# EAGLE design ESP_Robo_Board (EAGLE 9.6.2)
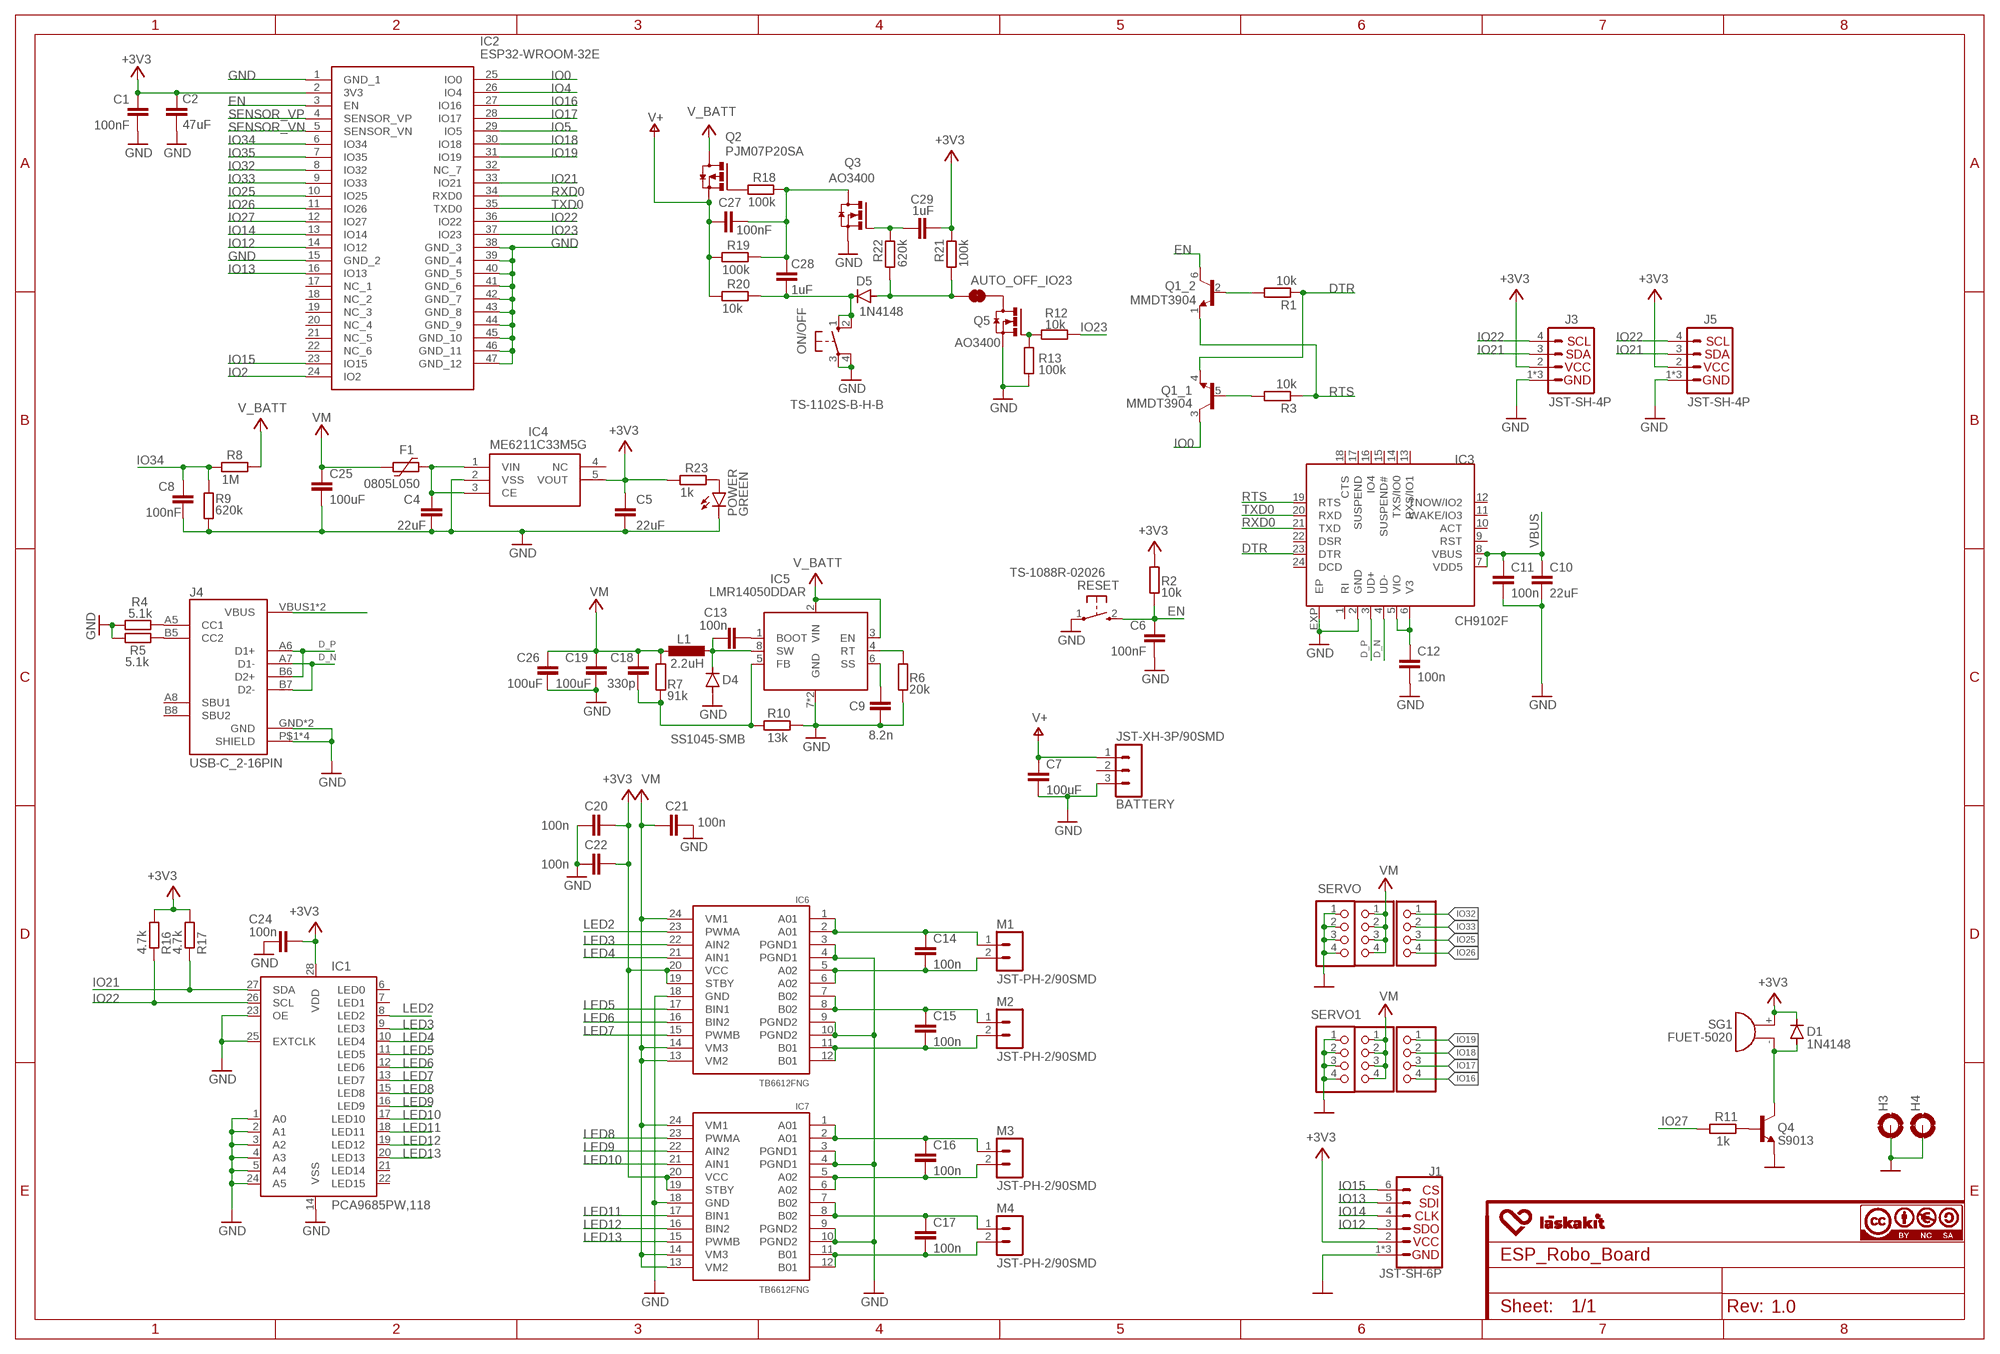
[diagram p0: schematic, sheet 1]
FRAME1 (FRAME-A3L): CREVISION: 1.0

## Parts
1  PINHD_1X4_RED  PINHD-1X4  [1X04]
2  PINHD_1X4_BLACK  PINHD-1X4  [1X04]
5  PINHD_1X4_RED  PINHD-1X4  [1X04]
6  PINHD_1X4_BLACK  PINHD-1X4  [1X04]
AUTO_OFF_IO23  nv  JUMPER-SMT_2_NC_TRACE_SILK  [SMT-JUMPER_2_NC_TRACE_SILK]
BATTERY  JST-XH-3P/90SMD  JST-XH-3/90SMD  [S3B-XH-SM4]
C1  100nF  C-EUC0603  [C0603]
C2  47uF  C-EUC0805  [C0805]
C4  22uF  C-EUC0603  [C0603]
C5  22uF  C-EUC0603  [C0603]
C6  100nF  CAPACITOR_0402  [C0402]
C7  100uF  C-EUC1206  [C1206]
C8  100nF  CAPACITOR_0402  [C0402]
C9  8.2n  C-EUC0603  [C0603]
C10  22uF  C-EUC0603  [C0603]
C11  100n  CAPACITOR_0402  [C0402]
C12  100n  CAPACITOR_0402  [C0402]
C13  100n  C-EUC0603  [C0603]
C14  100n  C-EUC0603  [C0603]
C15  100n  C-EUC0603  [C0603]
C16  100n  C-EUC0603  [C0603]
C17  100n  C-EUC0603  [C0603]
C18  330p  CAPACITOR_0402  [C0402]
C19  100uF  C-EUC1206  [C1206]
C20  100n  C-EUC0603  [C0603]
C21  100n  C-EUC0603  [C0603]
C22  100n  C-EUC0603  [C0603]
C24  100n  C-EUC0603  [C0603]
C25  100uF  C-EUC1206  [C1206]
C26  100uF  C-EUC1206  [C1206]
C27  100nF  CAPACITOR_0402  [C0402]
C28  1uF  C-EUC0603  [C0603]
C29  1uF  C-EUC0603  [C0603]
D1  1N4148  DIODE-SOD323-R  [SOD323-R]
D4  SS1045-SMB  DIODE-SMB  [SMB]
D5  1N4148  DIODE-SOD323-R  [SOD323-R]
F1  0805L050  [0805L]
H3  MOUNT-PAD-ROUND2.5  [2,5-PAD]
H4  MOUNT-PAD-ROUND2.5  [2,5-PAD]
IC1  PCA9685PW,118  [TSSOP28]
IC2  ESP32-WROOM-32E  [ESP32WROOM32E]
IC3  CH9102F  USB_UART_CONVERTOR_CH9102  [QFN24-4X4]
IC4  ME6211C33M5G  LDO_ME6211C33M5G  [SOT23-5]
IC5  LMR14050DDAR  [SO08-EPAD]
IC6  TB6612FNG  MOTOR_DRIVER_TB6612FNG  [SSOP24]
IC7  TB6612FNG  MOTOR_DRIVER_TB6612FNG  [SSOP24]
J1  JST-SH-6P  USUP_SPI_CONNECTOR_VERT  [1X06_1MM_RA_VERT]
J3  JST-SH-4P  USUP_I2C_CONNECTOR_VERT  [1X04_1MM_RA_VERT]
J4  USB-C_2-16PIN  [USBC_USB-C-16P-5]
J5  JST-SH-4P  USUP_I2C_CONNECTOR_VERT  [1X04_1MM_RA_VERT]
L1  2.2uH  INDUCTOR_5.4X5.2  [L5.4X5.2]
M1  JST-PH-2/90SMD  [S2B-PH-SM4]
M2  JST-PH-2/90SMD  [S2B-PH-SM4]
M3  JST-PH-2/90SMD  [S2B-PH-SM4]
M4  JST-PH-2/90SMD  [S2B-PH-SM4]
ON/OFF  TS-1102S-B-H-B  10-XX-SMD  [B3F-SMD]
POWER  GREEN  LEDCHIPLED_0402  [CHIPLED_0402]
Q1  MMDT3904  TRANS_NPN_DUAL-MBT3904DW1T1  [SC70-6]
Q2  PJM07P20SA  MOSFET_P-SOT-23  [SOT23]
Q3  AO3400  MOSFET_N-SOT-23  [SOT23]
Q4  S9013  BC817-16-NPN-SOT23-BEC  [SOT23-BEC]
Q5  AO3400  MOSFET_N-SOT-23  [SOT23]
R1  10k  R-EU_R0402  [R0402]
R2  10k  R-EU_R0402  [R0402]
R3  10k  R-EU_R0402  [R0402]
R4  5.1k  R-EU_R0402  [R0402]
R5  5.1k  R-EU_R0402  [R0402]
R6  20k  R-EU_R0402  [R0402]
R7  91k  R-EU_R0402  [R0402]
R8  1M  R-EU_R0402  [R0402]
R9  620k  R-EU_R0402  [R0402]
R10  13k  R-EU_R0402  [R0402]
R11  1k  R-EU_R0402  [R0402]
R12  10k  R-EU_R0402  [R0402]
R13  100k  R-EU_R0402  [R0402]
R16  4.7k  R-EU_R0402  [R0402]
R17  4.7k  R-EU_R0402  [R0402]
R18  100k  R-EU_R0402  [R0402]
R19  100k  R-EU_R0402  [R0402]
R20  10k  R-EU_R0402  [R0402]
R21  100k  R-EU_R0402  [R0402]
R22  620k  R-EU_R0402  [R0402]
R23  1k  R-EU_R0402  [R0402]
RESET  TS-1088R-02026  MOMENTARY_SWITCH_TS-1088R-02026  [TS1088R02026]
SERVO  PINHD_1X4_YELLOW  PINHD-1X4  [1X04]
SERVO1  PINHD_1X4_YELLOW  PINHD-1X4  [1X04]
SG1  FUET-5020  PASSIVE_BUZZER_3V_FUET-5020  [FUET-5020]

## Nets
+3V3: C1.1 C2.1 C5.1 C20.2 C22.2 C24.2 C29.1 D1.C IC1.28(VDD) IC2.2(3V3) IC4.5(VOUT) IC6.19(STBY) IC6.20(VCC) IC7.19(STBY) IC7.20(VCC) J1.2(VCC) J3.2(VCC) J5.2(VCC) R2.1 R16.2 R17.2 R21.2 R23.1 SG1.+
+6V: 1.1 1.2 1.3 1.4 5.1 5.2 5.3 5.4 C18.1 C19.1 C21.1 C25.1 C26.1 F1.2 IC6.13(VM2) IC6.14(VM3) IC6.24(VM1) IC7.13(VM2) IC7.14(VM3) IC7.24(VM1) L1.2 R7.1 ; supply symbol labelled VM
D_N: IC3.4(UD-) J4.A7(D1-) J4.B7(D2-)
D_P: IC3.3(UD+) J4.A6(D1+) J4.B6(D2+)
DTR: IC3.23(DTR) Q1.4(_1:E) R1.1
EN: C6.1 IC2.3(EN) Q1.6(_2:C) R2.2 RESET.2
GND: 2.1 2.2 2.3 2.4 6.1 6.2 6.3 6.4 BATTERY.3 C1.2 C2.2 C4.2 C5.2 C6.2 C7.2 C8.2 C9.2 C10.2 C11.2 C12.2 C19.2 C20.1 C21.2 C22.1 C24.1 C25.2 C26.2 D4.A H3.1(MOUNT) H4.1(MOUNT) IC1.1(A0) IC1.2(A1) IC1.3(A2) IC1.4(A3) IC1.5(A4) IC1.14(VSS) IC1.23(OE) IC1.24(A5) IC1.25(EXTCLK) IC2.1(GND_1) IC2.15(GND_2) IC2.38(GND_3) IC2.39(GND_4) IC2.40(GND_5) IC2.41(GND_6) IC2.42(GND_7) IC2.43(GND_8) IC2.44(GND_9) IC2.45(GND_10) IC2.46(GND_11) IC2.47(GND_12) IC3.2(GND) IC3.EXP(EP) IC4.2(VSS) IC5.7(GND) IC5.EPAD(GND) IC6.3(PGND1) IC6.4(PGND1) IC6.9(PGND2) IC6.10(PGND2) IC6.18(GND) IC7.3(PGND1) IC7.4(PGND1) IC7.9(PGND2) IC7.10(PGND2) IC7.18(GND) J1.1(GND) J1.NC1(GND) J1.NC2(GND) J3.1(GND) J3.NC1(GND) J3.NC2(GND) J4.GND J4.GND2(GND) J4.P$1(SHIELD) J4.P$2(SHIELD) J4.P$3(SHIELD) J4.P$4(SHIELD) J5.1(GND) J5.NC1(GND) J5.NC2(GND) ON/OFF.3(P) ON/OFF.4(P1) POWER.C Q3.2(S) Q4.E Q5.2(S) R4.1 R5.1 R6.2 R9.1 R10.2 R13.1 RESET.1
IO0: IC2.25(IO0) Q1.3(_1:C)
IO2: IC2.24(IO2)
IO4: IC2.26(IO4)
IO5: IC2.29(IO5)
IO12: IC2.14(IO12) J1.3(SDO)
IO13: IC2.16(IO13) J1.5(SDI)
IO14: IC2.13(IO14) J1.4(CLK)
IO15: IC2.23(IO15) J1.6(CS)
IO16: IC2.27(IO16) SERVO1.4
IO17: IC2.28(IO17) SERVO1.3
IO18: IC2.30(IO18) SERVO1.2
IO19: IC2.31(IO19) SERVO1.1
IO21: IC1.27(SDA) IC2.33(IO21) J3.3(SDA) J5.3(SDA) R17.1
IO22: IC1.26(SCL) IC2.36(IO22) J3.4(SCL) J5.4(SCL) R16.1
IO23: IC2.37(IO23) R12.2
IO25: IC2.10(IO25) SERVO.3
IO26: IC2.11(IO26) SERVO.4
IO27: IC2.12(IO27) R11.1
IO32: IC2.8(IO32) SERVO.1
IO33: IC2.9(IO33) SERVO.2
IO34: C8.1 IC2.6(IO34) R8.1 R9.2
IO35: IC2.7(IO35)
LED2: IC1.8(LED2) IC6.23(PWMA)
LED3: IC1.9(LED3) IC6.22(AIN2)
LED4: IC1.10(LED4) IC6.21(AIN1)
LED5: IC1.11(LED5) IC6.17(BIN1)
LED6: IC1.12(LED6) IC6.16(BIN2)
LED7: IC1.13(LED7) IC6.15(PWMB)
LED8: IC1.15(LED8) IC7.23(PWMA)
LED9: IC1.16(LED9) IC7.22(AIN2)
LED10: IC1.17(LED10) IC7.21(AIN1)
LED11: IC1.18(LED11) IC7.17(BIN1)
LED12: IC1.19(LED12) IC7.16(BIN2)
LED13: IC1.20(LED13) IC7.15(PWMB)
N$1: C4.1 F1.1 IC4.1(VIN) IC4.3(CE)
N$2: J4.A5(CC1) R4.2
N$3: C13.1 D4.C IC5.8(SW) L1.1
N$4: Q1.5(_1:B) R3.2
N$5: C9.1 IC5.6(SS)
N$6: IC5.4(RT) R6.1
N$7: J4.B5(CC2) R5.2
N$8: Q4.B R11.2
N$9: POWER.A R23.2
N$10: C13.2 IC5.1(BOOT)
N$12: Q1.2(_2:B) R1.2
N$13: Q5.1(G) R12.1 R13.2
N$14: D1.A Q4.C SG1.-
N$15: C12.1 IC3.5(VIO) IC3.6(V3)
N$16: AUTO_OFF_IO23.2 Q5.3(D)
N$17: C18.2 IC5.5(FB) R7.2 R10.1
N$18: C14.1 IC6.1(A01) IC6.2(A01) M1.1
N$19: C14.2 IC6.5(A02) IC6.6(A02) M1.2
N$20: C15.1 IC6.7(B02) IC6.8(B02) M2.1
N$22: Q2.1(G) R18.1
N$23: C15.2 IC6.11(B01) IC6.12(B01) M2.2
N$24: C16.1 IC7.1(A01) IC7.2(A01) M3.1
N$25: C28.2 D5.C ON/OFF.1(S) ON/OFF.2(S1) R20.2
N$26: C16.2 IC7.5(A02) IC7.6(A02) M3.2
N$27: C17.1 IC7.7(B02) IC7.8(B02) M4.1
N$28: C27.2 C28.1 Q3.3(D) R18.2 R19.2
N$29: C17.2 IC7.11(B01) IC7.12(B01) M4.2
N$30: C29.2 Q3.1(G) R22.2
N$31: AUTO_OFF_IO23.1 D5.A R21.1 R22.1
RTS: IC3.19(RTS) Q1.1(_2:E) R3.1
RXD0: IC2.34(RXD0) IC3.21(TXD)
SENSOR_VN: IC2.5(SENSOR_VN)
SENSOR_VP: IC2.4(SENSOR_VP)
TXD0: IC2.35(TXD0) IC3.20(RXD)
V+: BATTERY.1 C7.1 C27.1 Q2.2(S) R19.1 R20.1
V_BATT: IC5.2(VIN) IC5.3(EN) Q2.3(D) R8.2
VBUS: C10.1 C11.1 IC3.7(VDD5) IC3.8(VBUS) J4.VBUS1(VBUS) J4.VBUS2(VBUS)
Unconnected: BATTERY.2 IC1.6(LED0) IC1.7(LED1) IC1.21(LED14) IC1.22(LED15) IC2.17(NC_1) IC2.18(NC_2) IC2.19(NC_3) IC2.20(NC_4) IC2.21(NC_5) IC2.22(NC_6) IC2.32(NC_7) IC3.1(RI) IC3.9(RST) IC3.10(ACT) IC3.11(WAKE/IO3) IC3.12(TNOW/IO2) IC3.13(RXS/IO1) IC3.14(TXS/IO0) IC3.15(SUSPEND#) IC3.16(IO4) IC3.17(SUSPEND) IC3.18(CTS) IC3.22(DSR) IC3.24(DCD) IC4.4(NC) J4.A8(SBU1) J4.B8(SBU2)

## Library data of the parts
1 2 5 6 SERVO SERVO1 = LasKKit-Connectors:PINHD-1X4: PIN HEADER
AUTO_OFF_IO23 = LaskaKit-Jumpers:JUMPER-SMT_2_NC_TRACE: Normally closed trace jumper This jumper has a trace between two pads so it's normally closed (NC). Use a razor knife to open the connection. For best results follow the IPC guidelines for cutting traces: Cutout at least 0.063 mm (0.005 in). Remove all loose material to clean up the cut area. Seal the cut with an approved epoxy. Reapply solder to reclose the connection.
BATTERY = LasKKit-Connectors:JST-XH-3
C1 C2 C4 C7 C9 C10 C13-C17 C19-C22 C24-C26 C28 C29 = rcl:C-EU: CAPACITOR, European symbol; SPICEPREFIX: C
C5 = rcl:C-EU: CAPACITOR, European symbol; LCSC_PART: C19666; SPICEPREFIX: C
C6 C8 C11 C12 C18 C27 = LasKKIT-Passive:CAPACITOR
D1 = LasKKit-Discrete:DIODE-: DIODE; LCSC_PART: C94001
D4 = diode:DIODE-: DIODE; LCSC_PART: C2903947
D5 = LasKKit-Discrete:DIODE-: DIODE
F1 = polyfuse-smd_10:?: Polyfuse Resettable PTC Source: http://www.littelfuse.com/products/resettable-ptcs.aspx; LCSC_PART: C66452; MF: Littelfuse; MPN: 0805L050; OC_FARNELL: 1832103; OC_NEWARK: 18M4776
H3 H4 = LasKKit-Holes:MOUNT-PAD-ROUND: MOUNTING PAD, round
IC1 = LasKKit-IC:PCA9685: 16-channel, 12-bit PWM Fm+ I2C-bus LED controller; LCSC_PART: C2678753
IC2 = LasKKit-Modules:ESP32-WROOM-32E: ESP32-D0WD-V3 embedded, Xtensa dual-core 32-bit LX6 microprocessor, up to 240 MHz Source: Datasheet <https://www.espressif.com/sites/default/files/documentation/esp32-wroom-32e_esp32-wroom-32ue_datasheet_en.pdf>; DESCRIPTION: ESP32-D0WD-V3 embedded, Xtensa dual-core 32-bit LX6 microprocessor, up to 240 MHz; HEIGHT: 3.25mm; MANUFACTURER_NAME: Espressif Systems; MANUFACTURER_PART_NUMBER: ESP32-WROOM-32E
IC3 = LasKKit-IC:USB_UART_CONVERTOR_CH9102: Single-Chip USB to UART Bridge
IC4 = LasKKit-Power:LDO_ME6211C33M5G: High Speed LDO Regulators, High PSRR, Low noise, ME6211 Series Source: Datasheet <http://xinhuidianzi.com.cn/UploadSysFiles/files/LDO-series/ME6211-Series_E15.0.pdf>; DESCRIPTION: High Speed LDO Regulators, High PSRR, Low noise, ME6211 Series; HEIGHT: 1.45mm; MANUFACTURER_NAME: Microne; MANUFACTURER_PART_NUMBER: ME6211C33M5G
IC5 = LasKKit-Power:LMR14050; LCSC_PART: C155484
IC6 IC7 = LasKKit-IC:MOTOR_DRIVER_TB6612FNG: Toshiba 1A dual motor driver IC-09363; PROD_ID: IC-09363
J1 = LasKKit-Connectors:USUP_SPI_CONNECTOR: LaskaKit SPI Standard μŠup Connector An SMD 1mm pitch JST connector makes it easy and quick (Šup) to connect SPI devices to each other. The μŠup system enables fast and solderless connection between popular platforms and various sensors and actuators.; LCSC_PART: C145963
J3 J5 = LasKKit-Connectors:USUP_I2C_CONNECTOR: LaskaKit I2C Standard μŠup Connector An SMD 1mm pitch JST connector makes it easy and quick (Šup) to connect I2C devices to each other. The μŠup system enables fast and solderless connection between popular platforms and various sensors and actuators.; LCSC_PART: C371588
J4 = LasKKit-Connectors:USB-C_2: https://lcsc.com/product-detail/USB-Connectors_G-Switch-GT-USB-7010B_C2837092.html; LCSC_PART: C2837092
L1 = LasKKIT-Passive:INDUCTOR; LCSC_PART: C351096
M1-M4 = LasKKit-Connectors:JST-PH-2: HEADER; LCSC_PART: C47647
ON/OFF = LasKKit-Switch:10-XX: OMRON SWITCH
POWER = LasKKit-Discrete:LED: LED OSRAM: - CHIPLED LG R971, LG N971, LY N971, LG Q971, LY Q971, LO R971, LY R971 LH N974, LH R974 LS Q976, LO Q976, LY Q976 LO Q996 - Hyper CHIPLED LW Q18S LB Q993, LB Q99A, LB R99A - SideLED LS A670, LO A670, LY A670, LG A670, LP A670 LB A673, LV A673, LT A673, LW A673 LH A674 LY A675 LS A676, LA A676, LO A676, LY A676, LW A676 LS A679, LY A679, LG A679 - Hyper Micro SIDELED® LS Y876, LA Y876, LO Y876, LY Y876 LT Y87S - SmartLED LW L88C, LW L88S LB L89C, LB L89S, LG L890 LS L89K, LO L89K, LY L89K LS L896, LA L896, LO L896, LY L896 - TOPLED LS T670, LO T670, LY T670, LG T670, LP T670 LSG T670, LSP T670, LSY T670, LOP T670, LYG T670 LG T671, LOG T671, LSG T671 LB T673, LV T673, LT T673, LW T673 LH T674 LS T676, LA T676, LO T676, LY T676, LB T676, LH T676, LSB T676, LW T676 LB T67C, LV T67C, LT T67C, LS T67K, LO T67K, LY T67K, LW E67C LS E67B, LA E67B, LO E67B, LY E67B, LB E67C, LV E67C, LT E67C LW T67C LS T679, LY T679, LG T679 LS T770, LO T770, LY T770, LG T770, LP T770 LB T773, LV T773, LT T773, LW T773 LH T774 LS E675, LA E675, LY E675, LS T675 LS T776, LA T776, LO T776, LY T776, LB T776 LHGB T686 LT T68C, LB T68C - Hyper Mini TOPLED® LB M676 - Mini TOPLED Santana® LG M470 LS M47K, LO M47K, LY M47K Source: http://www.osram.convergy.de LUXEON: - LUMILED® LXK2-PW12-R00, LXK2-PW12-S00, LXK2-PW14-U00, LXK2-PW14-V00 LXK2-PM12-R00, LXK2-PM12-S00, LXK2-PM14-U00 LXK2-PE12-Q00, LXK2-PE12-R00, LXK2-PE12-S00, LXK2-PE14-T00, LXK2-PE14-U00 LXK2-PB12-K00, LXK2-PB12-L00, LXK2-PB12-M00, LXK2-PB14-N00, LXK2-PB14-P00, LXK2-PB14-Q00 LXK2-PR12-L00, LXK2-PR12-M00, LXK2-PR14-Q00, LXK2-PR14-R00 LXK2-PD12-Q00, LXK2-PD12-R00, LXK2-PD12-S00 LXK2-PH12-R00, LXK2-PH12-S00 LXK2-PL12-P00, LXK2-PL12-Q00, LXK2-PL12-R00 Source: www.luxeon.com KINGBRIGHT: KA-3528ASYC Source: www.kingbright.com
Q1 = LasKKit-Discrete:TRANS_NPN_DUAL: Dual NPN Transistors in Single Package The MBT3904W1 puts two general purpose 3904 NPN transistors in a single package. Datasheet <http://www.onsemi.com/pub_link/Collateral/MBT3904DW1T1-D.PDF> SparkFun Products: SparkFun ESP32 Thing <https://www.sparkfun.com/products/13907>; LCSC_PART: C268586; PROD_ID: TRANS-13337
Q2 = LasKKit-Discrete:MOSFET_P; LCSC_PART: C2856842
Q3 Q5 = LasKKit-Discrete:MOSFET_N; LCSC_PART: C693097
Q4 = transistor:*-NPN-: NPN Transistror BF959 corrected 2008.03.06; LCSC_PART: C52801
R1-R10 R12 R13 R16-R23 = rcl:R-EU_: RESISTOR, European symbol; SPICEPREFIX: R
R11 = rcl:R-EU_: RESISTOR, European symbol; LCSC_PART: C22548; SPICEPREFIX: R
RESET = LasKKit-Switch:MOMENTARY_SWITCH_TS-1088R-02026: SMD,3x4x2.0mm Tactile Switches Source: Datasheet <https://datasheet.lcsc.com/szlcsc/1912111437_XUNPU-TS-1088R-02026_C455280.pdf>; DESCRIPTION: SMD,3x4x2.0mm Tactile Switches; HEIGHT: 2.2mm; LCSC_PART: C455280; MANUFACTURER_NAME: XUNPU; MANUFACTURER_PART_NUMBER: TS-1088R-02026
SG1 = LasKKit-Electromechanical:PASSIVE_BUZZER_3V; LCSC_PART: C391029

## Net classes
1 power: width 0.152 mm, drill 0.33 mm, clearance 0.152 mm

## Board
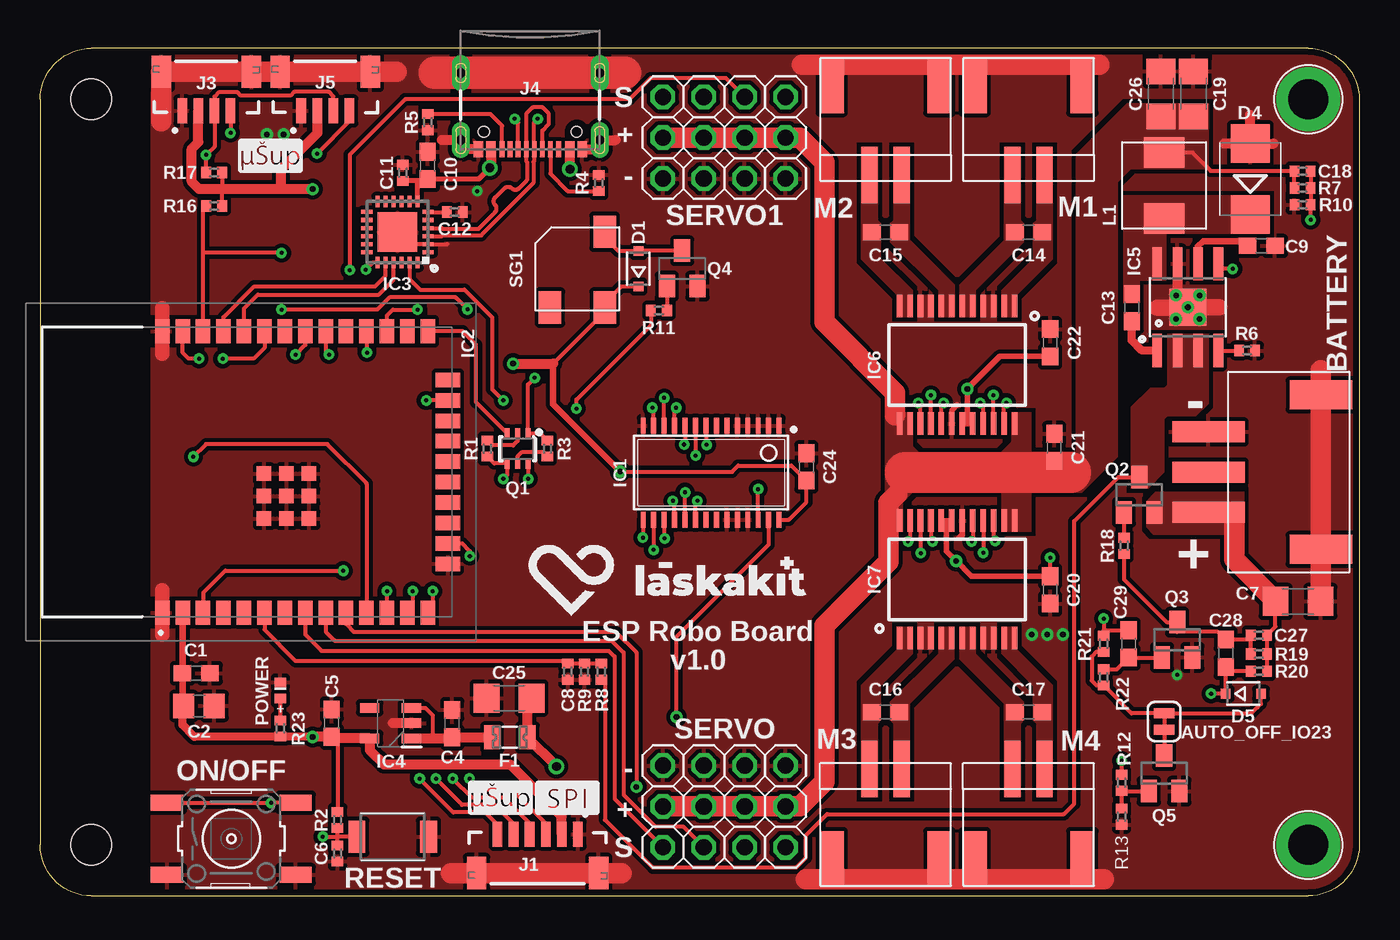
[diagram p1: board, top side]
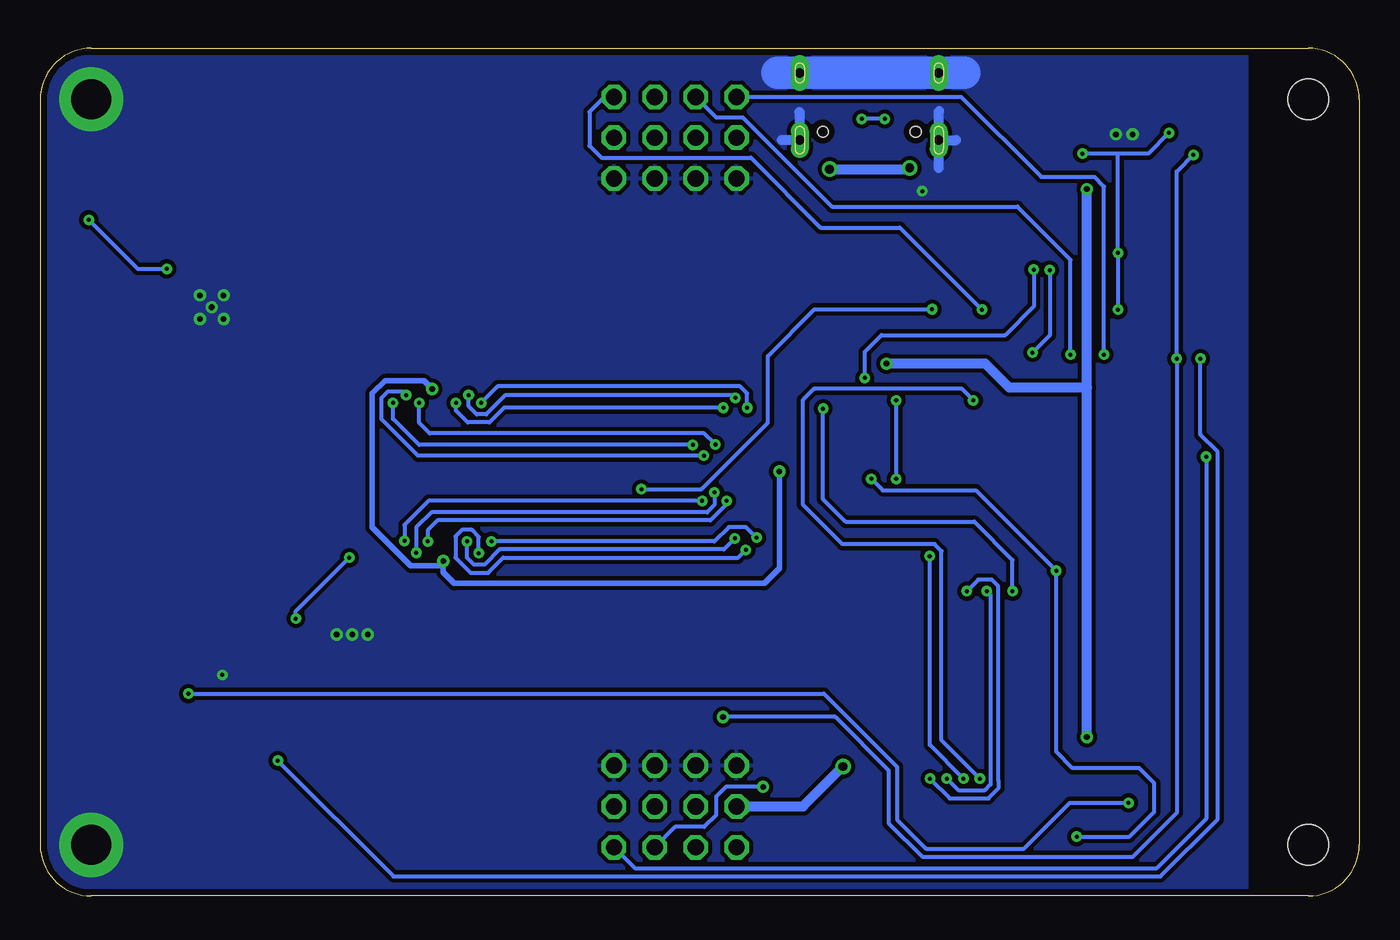
[diagram p2: board, bottom side, seen from below]

Size 82.04 x 52.7 mm. Coordinates in mm from the lower left corner, seen from the top.
Outline: 3.17,0 78.87,0 arc90 82.04,3.17 82.04,49.53 arc90 78.87,52.7 3.17,52.7 arc90 0,49.53 0,3.17 arc90 3.17,0
Copper layers (1*16): Top 0.035mm / dielectric 1.5mm / Bottom 0.035mm
Design rules "default *": minimum track width 10mil, minimum drill 0.25mm, track to track 6mil, track to pad 6mil, pad to pad 6mil, via to via 6mil, smd to smd 6mil, copper to edge 16mil, drill to drill 6mil, minimum pad ring 10mil, minimum via ring 8mil, stop-mask expansion 4mil, vias tented up to drill 25mil, thermal gap 10mil
Holes 2.5 mm at 3.17,3.17 3.17,49.53

### Footprints (pad centres in the part's own frame; a part is rotated, then mirrored left to right if it is on the bottom)
1X04 = drill 1.016 octagon: 1 -3.81,0; 2 -1.27,0; 3 1.27,0; 4 3.81,0
SMT-JUMPER_2_NC_TRACE_SILK = smd 0.635 x 1.27: 1 -0.508,0; 2 0.508,0
S3B-XH-SM4 = smd 1.3 x 4.5: 1 2.5,-8.75; 2 0,-8.75; 3 -2.5,-8.75 | smd 1.8 x 3.9: P$1 -4.8,-1.75; P$2 4.8,-1.75
C0603 = smd 1.1 x 1: 1 -0.85,0; 2 0.85,0
C0805 = smd 1.3 x 1.5: 1 -0.95,0; 2 0.95,0
C0402 = smd 0.6 x 0.7: 1 -0.5,0; 2 0.5,0
C1206 = smd 1.6 x 1.8: 1 -1.4,0; 2 1.4,0
SOD323-R = smd 0.6 x 0.6: A 1.1,0; C -1.1,0
SMB = smd 2.4 x 2.4: A 2.2,0; C -2.2,0
0805L = smd 1 x 1.5: 1 -1.1,0; 2 1.1,0
2,5-PAD = drill 2.5 pad 4: 1 0,0
TSSOP28 = smd 0.305 x 0.991: 1 -4.225,-2.918; 2 -3.575,-2.918; 3 -2.925,-2.918; 4 -2.275,-2.918; 5 -1.625,-2.918; 6 -0.975,-2.918; 7 -0.325,-2.918; 8 0.325,-2.918; 9 0.975,-2.918; 10 1.625,-2.918; 11 2.275,-2.918; 12 2.925,-2.918; 13 3.575,-2.918; 14 4.225,-2.918; 15 4.225,2.918; 16 3.575,2.918; 17 2.925,2.918; 18 2.275,2.918; 19 1.625,2.918; 20 0.975,2.918; 21 0.325,2.918; 22 -0.325,2.918; 23 -0.975,2.918; 24 -1.625,2.918; 25 -2.275,2.918; 26 -2.925,2.918; 27 -3.575,2.918; 28 -4.225,2.918
ESP32WROOM32E = smd 1.5 x 0.9: 1 -8.742,8.28; 2 -8.742,7.01; 3 -8.742,5.74; 4 -8.742,4.47; 5 -8.742,3.2; 6 -8.742,1.93; 7 -8.742,0.66; 8 -8.742,-0.61; 9 -8.742,-1.88; 10 -8.742,-3.15; 11 -8.742,-4.42; 12 -8.742,-5.69; 13 -8.742,-6.96; 14 -8.742,-8.23; 25 8.758,-8.23; 26 8.758,-6.96; 27 8.758,-5.69; 28 8.758,-4.42; 29 8.758,-3.15; 30 8.758,-1.88; 31 8.758,-0.61; 32 8.758,0.66; 33 8.758,1.93; 34 8.758,3.2; 35 8.758,4.47; 36 8.758,5.74; 37 8.758,7.01; 38 8.758,8.28 | smd 0.9 x 1.5: 15 -5.702,-9.48; 16 -4.432,-9.48; 17 -3.162,-9.48; 18 -1.892,-9.48; 19 -0.622,-9.48; 20 0.648,-9.48; 21 1.918,-9.48; 22 3.188,-9.48; 23 4.458,-9.48; 24 5.728,-9.48 | smd 0.9 x 0.9: 39 -1.492,0.56; 40 -1.492,-0.84; 41 -0.092,-0.84; 42 -0.092,0.56; 43 -0.092,1.96; 44 -1.492,1.96; 45 -2.892,1.96; 46 -2.892,0.56; 47 -2.892,-0.84
QFN24-4X4 = smd 0.7 x 0.25: 1 -1.9,1.25; 2 -1.9,0.75; 3 -1.9,0.25; 4 -1.9,-0.25; 5 -1.9,-0.75; 6 -1.9,-1.25; 13 1.9,-1.25; 14 1.9,-0.75; 15 1.9,-0.25; 16 1.9,0.25; 17 1.9,0.75; 18 1.9,1.25 | smd 0.25 x 0.7: 7 -1.25,-1.9; 8 -0.75,-1.9; 9 -0.25,-1.9; 10 0.25,-1.9; 11 0.75,-1.9; 12 1.25,-1.9; 19 1.25,1.9; 20 0.75,1.9; 21 0.25,1.9; 22 -0.25,1.9; 23 -0.75,1.9; 24 -1.25,1.9 | smd 2.45 x 2.45: EXP 0,0
SOT23-5 = smd 1.2 x 0.6: 1 -1.3,0.95; 2 -1.3,0; 3 -1.3,-0.95; 4 1.3,-0.95; 5 1.3,0.95
SO08-EPAD = smd 0.61 x 2.057: 1 -1.905,-2.692; 2 -0.635,-2.692; 3 0.635,-2.692; 4 1.905,-2.692; 5 1.905,2.692; 6 0.635,2.692; 7 -0.635,2.692; 8 -1.905,2.692 | smd 2.286 x 2.286: EPAD 0,0
SSOP24 = smd 0.348 x 1.397: 1 -3.575,-3.656; 2 -2.925,-3.656; 3 -2.275,-3.656; 4 -1.625,-3.656; 5 -0.975,-3.656; 6 -0.325,-3.656; 7 0.325,-3.656; 8 0.975,-3.656; 9 1.625,-3.656; 10 2.275,-3.656; 11 2.925,-3.656; 12 3.575,-3.656; 13 3.575,3.656; 14 2.925,3.656; 15 2.275,3.656; 16 1.625,3.656; 17 0.975,3.656; 18 0.325,3.656; 19 -0.325,3.656; 20 -0.975,3.656; 21 -1.625,3.656; 22 -2.275,3.656; 23 -2.925,3.656; 24 -3.575,3.656
1X06_1MM_RA_VERT = smd 0.6 x 1.55: 1 -2.5,0.775; 2 -1.5,0.775; 3 -0.5,0.775; 4 0.5,0.775; 5 1.5,0.775; 6 2.5,0.775 | smd 1.2 x 2: NC1 -3.8,3.2; NC2 3.8,3.2
1X04_1MM_RA_VERT = smd 0.6 x 1.55: 1 -1.5,0.775; 2 -0.5,0.775; 3 0.5,0.775; 4 1.5,0.775 | smd 1.2 x 2: NC1 -2.8,3.2; NC2 2.8,3.2
USBC_USB-C-16P-5 = smd 0.3 x 1: A5 -1.25,-0.34; A6 -0.25,-0.34; A7 0.25,-0.34; A8 1.25,-0.34; B5 1.75,-0.34; B6 0.75,-0.34; B7 -0.75,-0.34; B8 -1.75,-0.34 | smd 0.6 x 1: GND -3.225,-0.34; GND2 3.225,-0.34; VBUS1 -2.45,-0.34; VBUS2 2.45,-0.34 | drill 0.6 pad 1.05 long: P$1 -4.32,-0.915; P$4 4.32,-0.915 | drill 0.6 pad 1 long: P$2 -4.32,-5.095; P$3 4.32,-5.095 | hole 0.65: -2.89,-1.445; 2.89,-1.445
L5.4X5.2 = smd 1.895 x 2.5: 1 -2.05,0; 2 2.05,0
S2B-PH-SM4 = smd 1 x 3.5: 1 1,-7.25; 2 -1,-7.25 | smd 1.5 x 3.4: P$1 -3.35,-1.7; P$2 3.35,-1.7
B3F-SMD = smd 2 x 1: 1 -4,2.25; 2 4,2.25; 3 -4,-2.25; 4 4,-2.25
CHIPLED_0402 = smd 0.6 x 0.7: A -0.5,0; C 0.5,0
SC70-6 = smd 0.3 x 0.66: 1 -0.65,-0.92; 2 0,-0.92; 3 0.65,-0.92; 4 0.65,0.92; 5 0,0.92; 6 -0.65,0.92
SOT23 = smd 1 x 1.4: 1 -0.95,-1.1; 2 0.95,-1.1; 3 0,1.1
SOT23-BEC = smd 1 x 1.4: B -0.95,-1.1; C 0,1.1; E 0.95,-1.1
R0402 = smd 0.6 x 0.7: 1 -0.5,0; 2 0.5,0
TS1088R02026 = smd 1.05 x 2: 1 -2.225,0; 2 2.225,0
FUET-5020 = smd 2 x 1.4: + -2.4,-1.7; - 2.3,-1.7; P$1 -2.4,1.7

### Placement (x,y rotation side)
1  42.55,5.56 0 top
2  42.55,8.1 0 top
5  42.55,47.14 0 top
6  42.55,44.6 0 top
AUTO_OFF_IO23  69.9,10.85 270 top
BATTERY  81.41,26.35 270 top
C1  9.7,13.84 0 top
C2  9.88,11.81 0 top
C4  25.63,10.72 90 top
C5  18.14,10.74 90 top
C6  18.49,2.64 270 top
C7  78.23,18.31 0 top
C8  32.82,13.94 270 top
C9  75.95,40.41 0 top
C10  24.1,45.42 90 top
C11  22.56,44.96 90 top
C12  25.78,42.52 0 top
C13  67.89,36.58 270 top
C14  61.47,41.27 180 top
C15  52.58,41.27 180 top
C16  52.58,11.43 0 top
C17  61.47,11.43 0 top
C18  78.51,45.06 0 top
C19  71.73,49.86 90 top
C20  62.81,19.02 90 top
C21  63.07,27.89 90 top
C22  62.81,34.39 270 top
C24  47.65,26.67 270 top
C25  29.16,12.29 180 top
C26  69.7,49.86 90 top
C27  75.79,16.21 180 top
C28  73.74,15.09 270 top
C29  67.69,15.67 270 top
D1  37.21,38.99 90 top
D4  75.26,44.58 90 top
D5  74.83,12.57 0 top
F1  29.21,9.86 0 top
H3  78.87,3.17 0 top
H4  78.87,49.53 0 top
IC1  41.73,26.31 180 top
IC2  15.88,26.35 90 top
IC3  22.23,41.27 180 top
IC4  21.79,10.74 180 top
IC5  71.37,36.6 0 top
IC6  57.02,33.02 180 top
IC7  57.02,19.68 0 top
J1  30.94,4.62 180 top
J3  10.34,48.03 0 top
J4  30.48,46.08 180 top
J5  17.73,48.03 0 top
L1  69.9,44.17 90 top
M1  61.47,52.07 0 top
M2  52.58,52.07 0 top
M3  52.58,0.64 180 top
M4  61.47,0.64 180 top
ON/OFF  11.89,3.56 0 top
POWER  14.94,12.78 90 top
Q1  29.69,27.81 180 top
Q2  68.35,24.94 0 top
Q3  70.71,15.93 0 top
Q4  39.93,39.01 0 top
Q5  69.9,7.62 0 top
R1  27.81,27.81 90 top
R2  18.49,4.72 270 top
R3  31.55,27.81 270 top
R4  34.75,44.32 270 top
R5  24.1,48.11 90 top
R6  75.06,33.91 0 top
R7  78.51,44.02 0 top
R8  34.9,13.94 270 top
R9  33.86,13.94 90 top
R10  78.51,42.98 180 top
R11  38.48,36.4 0 top
R12  67.26,7.04 90 top
R13  67.26,4.93 90 top
R16  10.82,42.9 0 top
R17  10.82,44.98 0 top
R18  67.41,21.77 270 top
R19  75.79,15.04 180 top
R20  75.79,13.97 180 top
R21  66.14,15.67 90 top
R22  66.14,13.59 90 top
R23  14.94,10.41 90 top
RESET  21.92,3.68 180 top
SERVO  42.55,3.02 0 top
SERVO1  42.55,49.68 0 top
SG1  33.4,38.99 90 top
U$1  [USUP_4MM_SILKSCREEN]  14.33,46 0 top
U$2  [USUP_4MM_SILKSCREEN]  28.63,6.1 0 top
U$3  [LASKKIT_20MM_SILKSCREEN]  39.19,19.56 0 top
U$4  [SPI_4MM_SILKSCREEN]  32.79,6.1 0 top

### Tracks (layer width: path | path; a pad name or v marks a point on that pad's centre or on a via)
+3V3  (via drill 0.25, 0.35)
  Top 0.254: R16.2 11.32,43.94 R17.2 | IC1.28 46.56,23.4 47.65,24.49 C24.2 46.72,26.75 43.41,26.75 43.03,26.36 36.09,26.36 v36.07,26.39 | R2.1 18.49,9.54 18.24,9.79 | D1.C 36.11,37.89 35.1,36.88 SG1.+ 35.1,36.3 31.9,33.1 | R23.1 14.91,9.89 | R21.2 66.14,16.52 | 66.14,16.52 C29.1 | C20.2 v62.81,21.03 | v66.14,17.25 66.14,16.52
  Top 0.356: IC7.19 56.38,23.34 | 56.38,23.34 IC7.20 | 57.67,29.36 v57.67,31.52 59.69,33.54 C22.2 | 57.67,29.36 IC6.19 | 57.67,29.36 IC6.20 | 56.38,23.34 56.38,21.44 v56.97,20.83 57.93,19.88 C20.2
  Top 0.406: IC2.2 8.87,13.84 C1.1 8.85,11.81 C2.1 | v36.07,26.39 31.9,30.56 31.9,33.1
  Top 0.508: 18.24,9.79 C5.1 | 8.85,11.81 8.85,10.63 9.59,9.89 14.91,9.89 16.94,9.89 v16.94,9.88
  Top 0.61: 18.24,9.79 IC4.5 20.49,9.07 21.39,8.18 29.21,8.18 32.44,4.95 J1.2 | C5.1 16.94,9.89 | J5.2 17.23,47.43 14.96,45.16 14.96,43.94 | v16.94,43.94 14.96,43.94 | 14.96,43.94 11.32,43.94 9.88,43.94 9.42,44.4 9.42,46.46 9.84,46.87 J3.2 | v29.41,33.1 31.9,33.1
  Bottom 0.254: v66.14,17.25 66.14,17.7 v62.81,21.03
  Bottom 0.305: 56.97,20.52 v56.97,20.83
  Bottom 0.356: v57.67,31.52 58.18,32.03 60.6,32.03 61.39,31.24 61.39,22.91 59,20.52 56.97,20.52 | v36.07,26.39 36.07,20.37 37.01,19.43 56.29,19.43 56.97,20.12 v56.97,20.83
  Bottom 0.61: v16.94,9.88 16.94,31.6 | 16.94,31.6 v16.94,43.94 | 16.94,31.6 21.77,31.6 23.27,33.1 v29.41,33.1
+6V  (via drill 0.55)
  Top 0.254: L1.2 71.66,46.22 72.8,45.09 77.99,45.09 C18.1 R7.1 | 53.16,29.87 53.16,29.65
  Top 0.508: 30.31,12.04 C25.1
  Top 0.61: 30.31,12.04 F1.2 30.31,9.85 v32.11,8.05
  Top 1.27: 5.1 5.2 5.3 5.4 47.24,47.14 48.77,45.62 48.77,35.69 53.16,31.29 53.16,29.87 | 1.1 1.2 1.3 1.4 47.24,5.56 48.77,7.09 48.77,16.79 52.76,20.78 52.76,24.46 53.31,25.02
  Top 2.54: 53.8,26.34 64.08,26.34
  Bottom 0.61: 1.1 34.59,5.56 v32.11,8.05
  pour Top (no thermals): 64.41,25.07 64.41,46.1 67.59,49.28 72.69,49.28 72.69,45.19 67.84,45.19 67.03,44.37 67.03,27.3 64.8,25.07
  pour Top (no thermals): 64.64,27.61 61.62,27.61 61.62,25.07 64.64,25.07
  pour Top (no thermals): 60.4,30.07 60.4,28.24 59.77,27.61 59.77,22.63 61.65,22.63 61.65,30.07
  pour Top (no thermals): 54.28,30.07 52.53,30.07 52.53,22.63 53.64,22.63 53.64,24.46 54.25,25.07 54.64,25.07 54.64,27.61 54.28,27.97
D_N
  Top 0.254: IC3.4 24.98,41.52 25.03,41.48 27.25,41.48 28.29,42.51 arc90 28.29,42.96 arc-90 28.29,43.41 28.87,43.99 arc-90 29.32,43.99 arc90 29.77,43.99 30.28,44.5 30.28,45.64 30.23,45.69 J4.A7 30.23,48.62 30.63,49.02 31.24,49.02 31.65,48.62 31.65,48.01 31.23,47.59 J4.B7
D_P  (via drill 0.25)
  Top 0.254: IC3.3 24.98,41.02 25.03,41.07 27.42,41.07 30.68,44.33 30.68,45.64 30.73,45.69 J4.A6 30.73,48.1 v30.94,48.31 | J4.B6 29.73,48.1 v29.52,48.31
  Bottom 0.254: v29.52,48.31 v30.94,48.31
DTR  (via drill 0.25)
  Top 0.254: R1.1 28.23,26.89 Q1.4 29.04,26.17 v28.8,25.93 | IC3.23 22.98,38.34 23.62,37.69 26.39,37.69 28.12,35.97 28.12,31.5 v28.8,30.81
  Bottom 0.254: v28.8,25.93 v28.8,30.81
EN  (via drill 0.25)
  Top 0.254: RESET.2 18.49,3.68 | 18.49,3.68 R2.2 | C6.1 18.49,3.68 | Q1.6 30.34,25.94 v30.35,25.93 | v17.58,3.68 18.49,3.68 | v18.85,20.22 11.51,20.22 10.16,18.87 10.16,17.78 IC2.3
  Bottom 0.254: v17.58,3.68 14.3,3.68 12.75,5.23 12.75,7.01 13.69,7.95 17.83,7.95 18.85,8.97 v18.85,20.22 23.85,25.22 29.64,25.22 v30.35,25.93
GND  (via drill 0.25, 0.35)
  Top 0.254: 25.34,40.52 IC3.2 22.98,40.52 IC3.EXP
  Top 0.356: IC7.18 57.35,22.45 57.15,22.25 | IC6.18 56.7,30.21 57.02,30.53
  Top 0.61: IC5.7 70.74,37.26 | D4.A 75.26,48.54 | D4.A 76.72,46.78 | D4.A 73.63,46.78 | D4.A 75.26,45.87 | J4.GND2 26.16,46.42 J4.P$4 24.99,46.99 | J4.GND 34.8,46.42 J4.P$1 35.79,46.99 | IC4.2 21.95,10.74
  Top 0.914: 7.59,36.55 IC2.38 7.59,33.71 | 7.59,19 IC2.1 7.59,16.23
  Top 1.016: 73.33,36.6 IC5.EPAD 71.35,36.58 69.49,36.58
  Top 1.27: 65.89,51.66 47.37,51.66 | 66.14,1.04 47.62,1.04 | 22.17,51.23 J5.NC2 J5.NC1 J3.NC2 J3.NC1 7.54,48.18 | 36.17,1.42 J1.NC1 J1.NC2 25.55,1.42 | C7.2 79.63,32.69
  Top 2.032: 24.53,51.17 J4.P$2 36.36,51.17
  Bottom 0.61: J4.P$4 26.16,48.77 26.14,48.79 | J4.P$4 26.16,45.26 | J4.P$4 25.07,46.99 | 35.91,46.99 J4.P$1 34.8,48.72 34.82,48.74
  Bottom 2.032: 24.55,51.17 J4.P$3 J4.P$2 36.18,51.17
  other vias: 71.37,36.6 70.64,37.34 72.11,37.34 70.64,35.86 72.11,35.86 70.71,13.74 27.18,43.81 14.1,47.35 15.14,47.35 61.67,16.26 62.64,16.26 63.6,16.26
  pour Top (isolate 0.254, rank 2): 6.99,0 6.99,52.7 82.04,52.7 82.04,0
  pour Bottom (isolate 0.254): 6.99,0 6.99,52.7 82.04,52.7 82.04,0
  pour Top (no thermals): 54.56,35.66 54.56,37.39 55.58,37.39 55.58,35.66
  pour Top (no thermals): 58.47,37.39 58.47,35.66 59.49,35.66 59.49,37.39
  pour Top (no thermals): 54.56,17.04 54.56,15.32 55.58,15.32 55.58,17.04
  pour Top (no thermals): 58.47,15.32 58.47,17.04 59.49,17.04 59.49,15.32
  pour Top (no thermals): 68.66,38 73.84,38 73.84,35.2 68.66,35.2
IO0
  Top 0.254: IC2.25 26.26,35.11 27.1,34.27 27.1,30.71 29.04,28.77 Q1.3
IO12  (via drill 0.25)
  Top 0.254: v24.41,18.95 24.41,17.92 IC2.14 | v26.7,7.29 27.36,6.63 29.31,6.63 31.44,4.5 J1.3
  Bottom 0.254: v26.7,7.29 25.48,6.07 23.06,6.07 22.96,6.17 22.45,6.68 22.45,7.19 22.45,7.42 22.45,19.25 22.86,19.66 23.7,19.66 v24.41,18.95
IO13  (via drill 0.25)
  Top 0.254: IC2.16 26.24,21.92 26.72,21.44 v26.72,21.13 | J1.5 29.44,4.5 28.27,5.66 26.24,5.66 v24.61,7.29
  Bottom 0.254: v24.61,7.29 26.72,9.4 v26.72,21.13
IO14  (via drill 0.25)
  Top 0.254: v23.16,18.95 23.16,17.94 IC2.13 | v25.65,7.29 26.82,6.12 28.83,6.12 30.44,4.51 J1.4
  Bottom 0.254: v25.65,7.29 24.94,6.58 23.29,6.58 22.94,6.93 22.94,18.72 v23.16,18.95
IO15  (via drill 0.25)
  Top 0.254: IC2.23 v24,30.81 | J1.6 28.44,4.43 27.68,5.19 25.69,5.19 v23.6,7.29
  Bottom 0.254: v23.6,7.29 25.98,9.68 25.98,21.44 26.42,21.87 32.16,21.87 34.59,24.31 34.59,30.84 33.91,31.52 24.71,31.52 v24,30.81
IO16  (via drill 0.25)
  Top 0.254: v23.47,36.45 21.92,36.45 21.57,36.09 IC2.27
  Bottom 0.254: v23.47,36.45 28.57,41.55 33.5,41.55 37.85,45.9 47.14,45.9 47.88,46.63 47.88,48.74 46.94,49.68 SERVO1.4
IO17  (via drill 0.25)
  Top 0.254: SERVO1.3 42.65,50.85 37.97,50.85 36.65,49.53 22.71,49.53 19.25,46.08 v19.25,38.91 | IC2.28 20.32,34.92 v20.32,33.78
  Bottom 0.254: v19.25,38.91 19.25,34.85 v20.32,33.78
IO18  (via drill 0.25)
  Top 0.254: IC2.30 17.75,33.86 v17.96,33.66
  Bottom 0.254: SERVO1.2 40.01,48.41 38.35,48.41 32.79,42.85 21.26,42.85 17.96,39.55 v17.96,33.66
IO19  (via drill 0.25)
  Top 0.254: IC2.31 | IC2.31 16.48,34.27 v15.88,33.66
  Bottom 0.254: v15.88,33.66 15.88,44.09 16.48,44.7 19.79,44.7 24.77,49.68 SERVO1.1
IO21  (via drill 0.25, 0.35)
  Top 0.254: IC2.33 13.95,34.07 13.28,33.4 v11.35,33.4 | R17.1 10.32,46.07 | 10.32,46.07 v10.31,46.08 | IC1.27 45.31,21.84 39.57,16.1 v39.57,11.12 | 10.32,46.07 10.84,46.59 J3.3 10.84,49.7 11.1,49.96 12.27,49.96 12.47,49.76 15.57,49.76 15.8,49.99 17.96,49.99 18.23,49.72 J5.3
  Bottom 0.254: v39.57,11.12 32.59,11.12 29.27,7.81 29.27,4.53 27.18,2.44 14.07,2.44 11.35,5.16 v11.35,33.4 11.35,45.03 v10.31,46.08
IO22  (via drill 0.25)
  Top 0.254: IC2.36 10.13,40.01 | IC1.26 v44.66,25.29 v44.65,25.3 | v26.57,36.47 25.83,37.21 21.72,37.21 20.95,36.45 v15.01,36.45 | v15.01,39.98 10.16,39.98 10.13,40.01 | J5.4 19.23,48.16 v17.22,46.15 | R16.1 10.13,42.72 10.13,40.01 | J3.4 v11.84,47.45
  Bottom 0.254: v44.65,25.3 40.92,25.3 36.79,29.43 36.79,33.57 33.88,36.47 v26.57,36.47 | v15.01,36.45 v15.01,39.98 15.01,46.13 15.04,46.15 | v11.84,47.45 13.13,46.15 15.04,46.15 | 15.04,46.15 v17.22,46.15
IO23  (via drill 0.25)
  Top 0.254: v9.88,33.4 9.22,33.4 8.87,33.76 IC2.37 | IC2.37 | R12.2 v67.26,8.41
  Bottom 0.254: v9.88,33.4 9.88,28.68 8.81,27.61 8.81,4.78 12.37,1.22 60.07,1.22 v67.26,8.41
IO25  (via drill 0.35)
  Top 0.254: IC2.10 19.02,16.92 19.53,16.41 35.81,16.41 37.08,15.14 v37.08,6.78
  Bottom 0.254: SERVO.3 42.55,4.29 40.74,4.29 40.01,5.03 40.01,6.17 39.4,6.78 v37.08,6.78
IO26  (via drill 0.25)
  Top 0.254: IC2.11 | IC2.11 20.3,25.65 17.86,28.09 10.31,28.09 v9.53,27.3
  Bottom 0.254: v9.53,27.3 9.53,4.8 12.6,1.73 45.06,1.73 SERVO.4
IO27  (via drill 0.25)
  Top 0.254: IC2.12 v21.57,18.95 | v21.57,18.95 | v33.35,30.3 33.35,30.85 37.98,35.48 R11.1
  Bottom 0.254: v21.57,18.95 21.57,20.88 23.95,23.27 31.95,23.27 33.35,24.66 v33.35,30.3
IO32
  Top 0.254: SERVO.1 35.73,6.03 35.73,14.87 35.36,15.24 17.5,15.24 16.48,16.26 IC2.8
IO33
  Top 0.254: SERVO.2 40.01,4.29 38.28,4.29 36.28,6.29 36.28,15.13 35.53,15.88 18.31,15.88 17.75,16.43 IC2.9
IO34
  Top 0.254: IC2.6 13.95,16.56 15.9,14.61 32.82,14.61 C8.1 R9.2 R8.1
LED2  (via drill 0.25)
  Top 0.254: IC6.23 59.95,30.51 v60.1,30.66 | IC1.8 41.41,28.09 v41.45,28.04
  Bottom 0.254: v41.45,28.04 58.47,28.04 60.1,29.67 v60.1,30.66
LED3  (via drill 0.25)
  Top 0.254: IC6.22 59.3,31.13 v59.28,31.14 | IC1.9 40.76,27.39 v40.77,27.38
  Bottom 0.254: v40.77,27.38 58.55,27.38 60.81,29.64 60.81,30.96 60.4,31.37 59.51,31.37 v59.28,31.14
LED4  (via drill 0.25)
  Top 0.254: IC6.21 58.65,30.48 v58.47,30.66 | IC1.10 40.11,28.12 v40.06,28.07
  Bottom 0.254: v40.06,28.07 40.74,28.75 57.81,28.75 58.47,29.41 v58.47,30.66
LED5  (via drill 0.25)
  Top 0.254: IC6.17 56.05,30.52 v56.19,30.66 | IC1.11 39.46,30.26 v39.55,30.35
  Bottom 0.254: v39.55,30.35 53.19,30.35 54.1,29.44 55.45,29.44 56.19,30.18 v56.19,30.66
LED6  (via drill 0.25)
  Top 0.254: IC6.16 v55.4,31.14 | IC1.12 v38.81,30.96
  Bottom 0.254: v38.81,30.96 38.96,31.11 53.14,31.11 54.3,29.95 54.89,29.95 55.4,30.45 v55.4,31.14
LED7  (via drill 0.25)
  Top 0.254: IC6.15 54.75,30.52 v54.61,30.66 | IC1.13 38.16,30.27 v38.08,30.35
  Bottom 0.254: v38.08,30.35 38.08,31.24 38.51,31.67 53.59,31.67 v54.61,30.66
LED8  (via drill 0.25)
  Top 0.254: IC7.23 54.1,22.17 v53.98,22.05 | IC1.15 37.51,22.29 v37.49,22.28
  Bottom 0.254: v37.49,22.28 38.15,22.94 39.22,22.94 40.11,22.05 v53.98,22.05
LED9  (via drill 0.25)
  Top 0.254: IC7.22 54.75,21.32 v54.76,21.31 | IC1.16 v38.16,21.52 v38.15,21.51
  Bottom 0.254: v54.76,21.31 54.76,22.33 55.19,22.76 55.8,22.76 56.21,22.35 56.21,21.03 55.27,20.09 54.18,20.09 53.24,21.03 38.63,21.03 v38.15,21.51
LED10  (via drill 0.25)
  Top 0.254: IC7.21 55.4,22.15 v55.5,22.05 | IC1.17 38.81,22.25 v38.84,22.23
  Bottom 0.254: v38.84,22.23 39.52,21.54 53.47,21.54 54.41,20.6 55.07,20.6 55.5,21.03 v55.5,22.05
LED11  (via drill 0.25)
  Top 0.254: IC7.17 58,22.11 v57.94,22.05 | IC1.18 39.46,24.45 v39.34,24.56
  Bottom 0.254: v39.34,24.56 39.34,24.36 40.36,23.34 57.33,23.34 57.94,22.73 v57.94,22.05
LED12  (via drill 0.25)
  Top 0.254: IC7.16 v58.65,21.34 | IC1.19 v40.11,25.09 | v40.11,25.09
  Bottom 0.254: v40.11,25.09 40.11,24.31 40.56,23.85 57.71,23.85 58.65,22.91 v58.65,21.34
LED13  (via drill 0.25)
  Top 0.254: IC7.15 59.3,22.16 v59.38,22.07 | IC1.20 40.76,24.45 v40.87,24.56
  Bottom 0.254: v40.87,24.56 57.89,24.56 59.38,23.06 v59.38,22.07
N$1
  Top 0.254: IC4.3 23.94,11.69 24.41,11.23 24.41,9.79
  Top 0.508: 25.63,9.79 C4.1 | 28.1,9.87 F1.1
  Top 0.61: IC4.1 24.41,9.79 25.63,9.79 | C4.1 28.1,9.87
N$2
  Top 0.254: J4.A5 31.73,44.9 32.81,43.82 R4.2
N$3
  pour Top (no thermals): 76.48,41.17 70.05,41.17 70.05,38.25 68.4,38.25 68.4,36.86 67.36,36.86 67.36,43.56 76.48,43.56
N$4
  Top 0.254: Q1.5 29.69,27.33 29.97,27.61 31.25,27.61 R3.2
N$5
  Top 0.406: IC5.6 72.01,40.39 72.34,40.72 74.79,40.72 C9.1
N$6
  Top 0.254: IC5.4 R6.1
N$7
  Top 0.254: J4.B5 28.73,47.88 28,48.61 R5.2
N$8
  Top 0.254: R11.2 Q4.B
N$9
  Top 0.254: POWER.A R23.2
N$10
  Top 0.508: IC5.1 68.53,33.91 67.89,34.54 C13.2
N$12
  Top 0.254: Q1.2 29.69,28.3 29.41,28.02 28.11,28.02 R1.2
N$13
  Top 0.254: Q5.1 67.28,6.52 R12.1 R13.2
N$14
  Top 0.254: Q4.C 37.24,40.11 D1.A 35.98,40.09 35.1,40.97 SG1.-
N$15
  Top 0.254: IC3.5 IC3.6 C12.1
N$16
  Top 0.254: AUTO_OFF_IO23.2 Q5.3
N$17  (via drill 0.25)
  Top 0.254: C18.2 R7.2 R10.1 v79.02,42.04 | v74.17,38.99 73.28,38.99 IC5.5
  Bottom 0.254: v79.02,42.04 75.97,38.99 v74.17,38.99
N$18
  pour Top (no thermals): 61.95,46.58 61.95,42.01 61.75,41.81 61.75,39.62 59.77,37.64 59.77,35.97 60.78,35.97 60.78,37.39 62.99,39.6 62.99,46.58
N$19
  pour Top (no thermals): 60.99,46.58 60.99,42.01 61.19,41.81 61.19,40.64 58.19,37.64 58.19,35.97 57.18,35.97 57.18,38 59.94,40.77 59.94,46.58
N$20
  pour Top (no thermals): 55.85,35.97 55.85,37.64 52.86,40.64 52.86,41.81 53.06,42.01 53.06,46.58 54.1,46.58 54.1,40.79 56.9,38 56.9,35.97
N$22
  Top 0.254: Q2.1 67.41,23.84 R18.1
N$23
  pour Top (no thermals): 54.28,35.97 54.28,37.64 52.3,39.62 52.3,41.81 52.1,42.01 52.1,46.58 51.05,46.58 51.05,39.6 53.26,37.39 53.26,35.97
N$24
  pour Top (no thermals): 54.28,16.74 54.28,15.06 52.3,13.08 52.3,10.92 52.1,10.72 52.1,6.12 51.05,6.12 51.05,13.11 53.26,15.32 53.26,16.74
N$25  (via drill 0.25)
  Top 0.254: R20.2 73.74,13.97 | 73.74,13.97 C28.2 | 73.74,13.97 73.73,13.97 D5.C v72.82,12.57 | 7.89,5.79 v14.35,5.79 15.89,5.79
  Top 0.406: ON/OFF.1 7.89,5.79 | ON/OFF.2 15.89,5.79
  Bottom 0.254: v14.35,5.79 18.01,5.79 20.85,2.95 26.95,2.95 28.75,4.75 28.75,8.03 33.3,12.57 v72.82,12.57
N$26
  pour Top (no thermals): 56.87,16.74 56.87,14.71 54.1,11.94 54.1,6.12 53.06,6.12 53.06,10.72 52.86,10.92 52.86,12.06 55.85,15.06 55.85,16.74
N$27
  pour Top (no thermals): 57.18,16.74 57.18,14.71 59.94,11.94 59.94,6.12 60.99,6.12 60.99,10.72 61.19,10.92 61.19,12.06 58.19,15.06 58.19,16.74
N$28
  Top 0.254: C27.2 75.29,15.94 | 75.29,15.94 C28.1 73.25,16.42 70.71,16.42 Q3.3 70.07,17.03 67.41,19.68 R18.2 | R19.2 75.29,15.94
N$29
  pour Top (no thermals): 59.77,16.74 59.77,15.06 61.75,13.08 61.75,10.92 61.95,10.72 61.95,6.12 62.99,6.12 62.99,13.11 60.78,15.32 60.78,16.74
N$30
  Top 0.254: R22.2 66.96,14.09 C29.2 Q3.1
N$31
  Top 0.254: D5.A 75.93,11.95 75.7,11.72 75.34,11.35 AUTO_OFF_IO23.1 67.88,11.35 R22.1 65.7,13.09 65.41,13.39 65.41,14.88 65.69,15.17 R21.1
RTS  (via drill 0.25)
  Top 0.254: R3.1 31.13,28.73 Q1.1 30.34,31.79 v30.76,32.21 | IC3.19 20.68,39.38 v20.24,38.94
  Bottom 0.254: v20.24,38.94 20.24,36.65 22.02,34.87 29.72,34.87 30.76,33.83 v30.76,32.21
RXD0
  Top 0.254: IC2.34 12.68,36.52 13.54,37.39 21.06,37.39 21.98,38.31 IC3.21
TXD0
  Top 0.254: IC2.35 11.4,35.99 13.31,37.9 20.83,37.9 21.48,38.54 IC3.20
V+
  Top 0.254: R20.1 R19.1 C27.1 76.83,16.74 C7.1
  Top 1.27: C7.1 76.83,18.37 74.27,20.93 74.27,23.57
  pour Top (no thermals): 68.78,24.54 69.37,25.12 74.9,25.12 74.9,22.45 69.24,22.45 68.78,22.91
V_BATT
  Top 0.254: R8.2 35.13,13.45 35.13,4.72 38.1,1.75 46.99,1.75 47.62,2.39 47.62,3.76 48.95,5.08 63.65,5.08 64.31,5.74 64.31,23.3 67.06,26.04 Q2.3
  pour Top (no thermals): 70.1,34.95 72.67,34.95 72.67,30.61 71.88,29.82 70.1,29.82 69.93,29.64 69.93,26.34 68.91,25.32 67.84,25.32 67.84,30.4 69.04,31.6 69.93,31.6 70.1,31.78
VBUS  (via drill 0.55)
  Top 0.254: IC3.8 IC3.7 | 24.13,44.45 C10.1
  Top 0.305: v27.96,45.26 27.27,44.56 C10.1 | 23.48,44.45 C11.1 | IC3.7 23.48,44.45 | 24.13,44.45 23.48,44.45
  Top 0.61: J4.VBUS2 28.03,45.33 v27.96,45.26 | J4.VBUS1 v32.93,45.2 v32.94,45.19
  Bottom 0.61: v32.94,45.19 28.04,45.19 v27.96,45.26

### Text on the board
tNames: S | + | - | - | + | ESP Robo Board | v1.0 | - | + | S